# Altium project Project1.PrjPcb
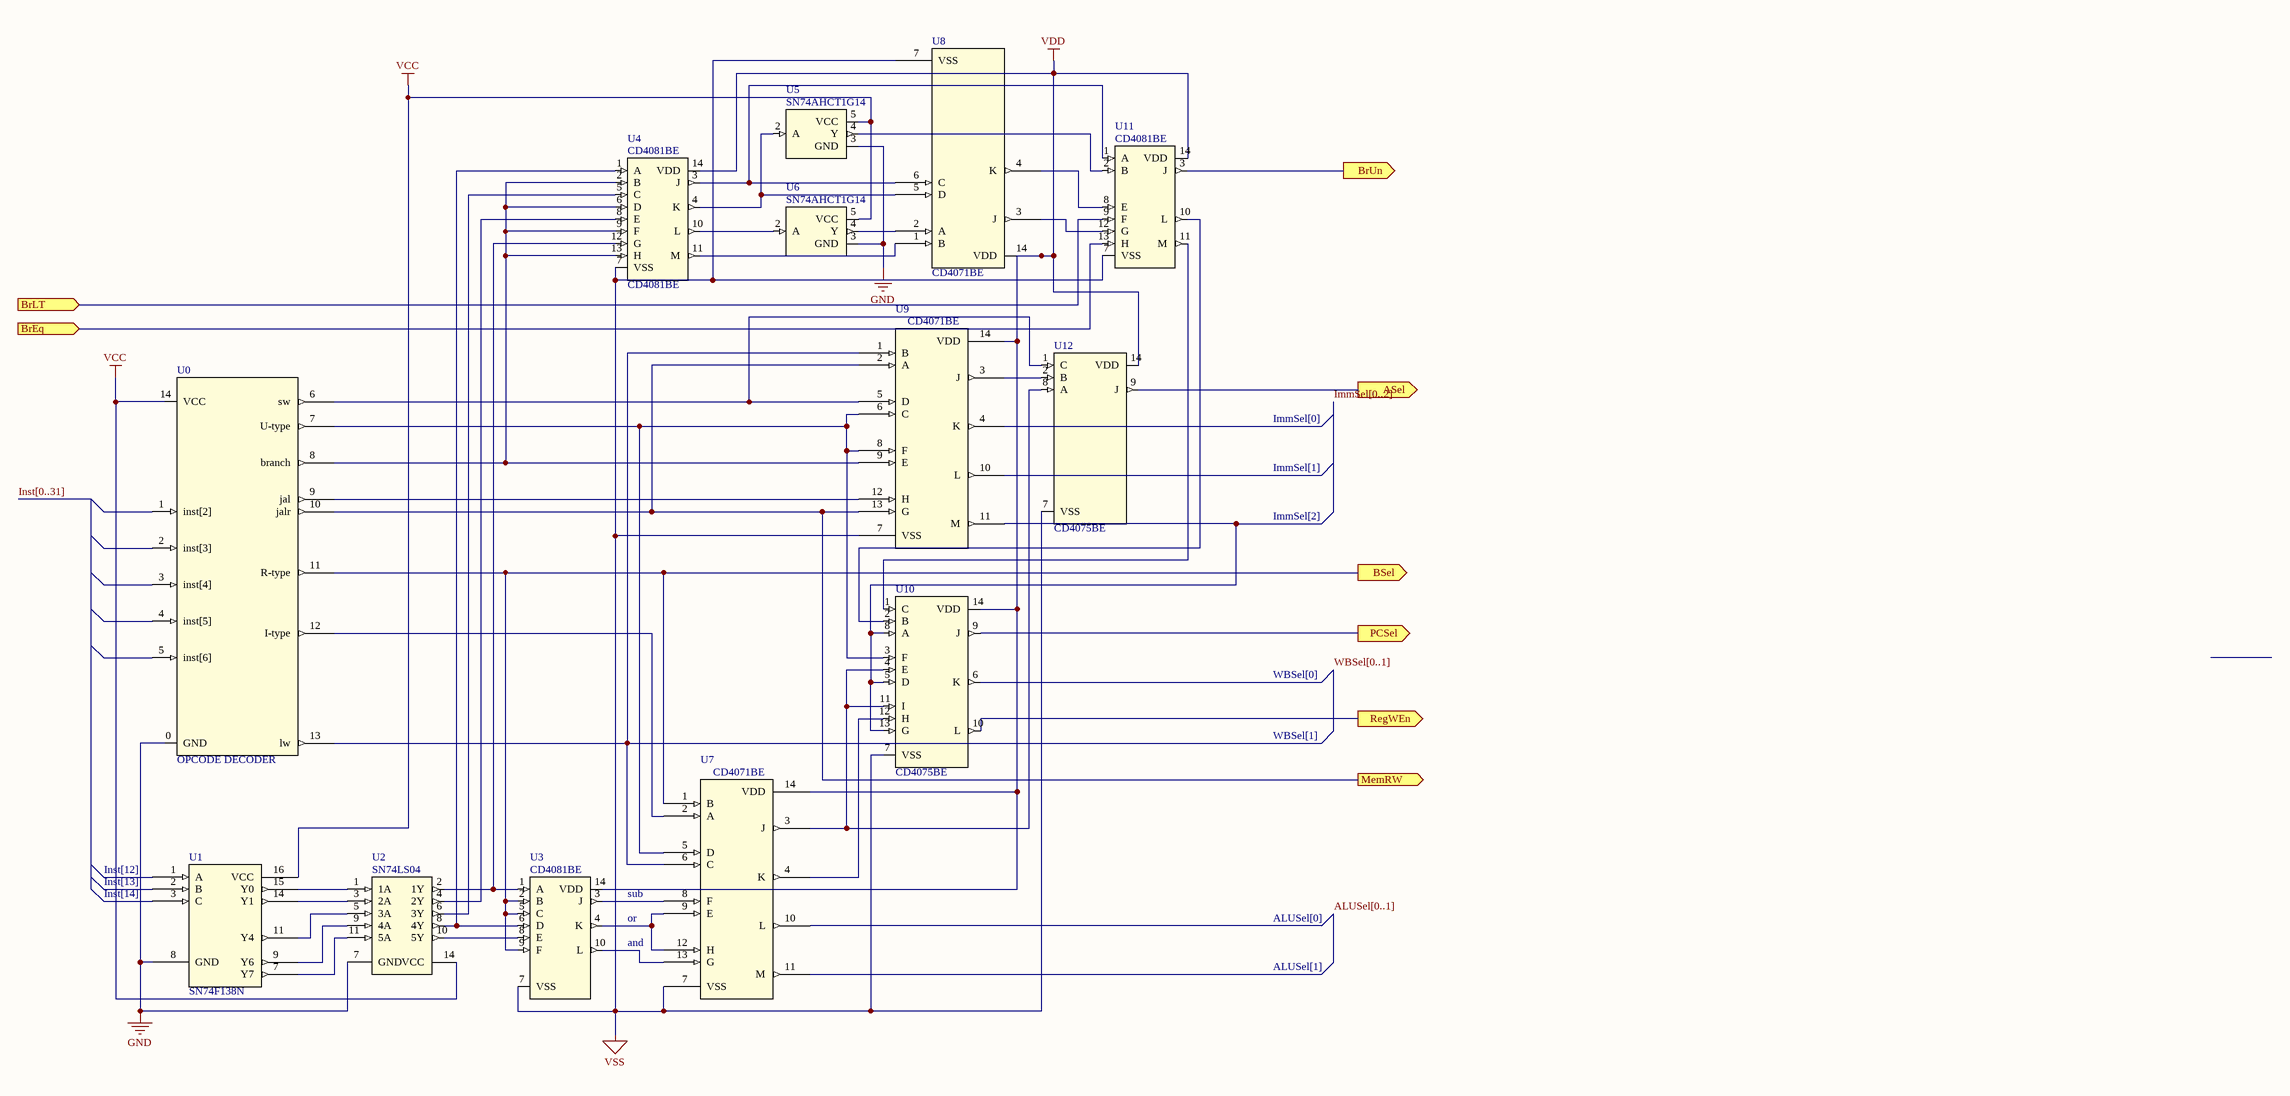
[diagram p0: project1.SchDoc]
1 sheet, 13 parts. Net scope: flat (ports and power ports of the same name join across sheets).

## Sheet project1.SchDoc
size 381 x 241 mm; SheetNumber: 1; SheetTotal: 1

### Parts
U0  OPCODE DECODER
U1  SN74F138N  [N16]
U2  SN74LS04N  [N14]  (value not drawn)
U3  CD4081BE  [N14]  (value not drawn)
U4  CD4081BE  [N14]
U5  CAHCT1G14QDCKRQ1  [DCK5_TEX]  (value not drawn)
U6  AHCT1G14QDCKRQ1  [DCK5_TEX]  (value not drawn)
U7  CD4071BE  [N14]  (value not drawn)
U8  CD4071BE  [N14]
U9  CD4071BE  [N14]  (value not drawn)
U10  CD4075BE  [N14]
U11  CD4081BE  [N14]  (value not drawn)
U12  CD4075BE  [N14]

### Ports
ASel (out), BrEq (in), BrLT (in), BrUn (out), BSel (out), MemRW (out), PCSel (out), RegWEn (out)

### Nets
GND: U0.0(GND) U1.8(GND) U2.7(GND) U5.3(GND) U6.3(GND)
VCC: U0.14(VCC) U1.16(VCC) U2.14(VCC) U5.5(VCC) U6.5(VCC)
VDD: U3.14(VDD) U4.14(VDD) U7.14(VDD) U8.14(VDD) U9.14(VDD) U10.14(VDD) U11.14(VDD) U12.14(VDD)
VSS: U3.7(VSS) U4.7(VSS) U7.7(VSS) U8.7(VSS) U9.7(VSS) U10.7(VSS) U11.7(VSS) U12.7(VSS)
NetU0_6: U0.6(sw) U9.5(D) U12.1(C)
NetU0_7: U0.7(U-type) U7.5(D) U9.6(C) U9.8(F) U10.3(F)
NetU0_8: U0.8(branch) U4.2(B) U4.6(D) U4.9(F) U4.13(H) U9.9(E)
NetU0_9: U0.9(jal) U9.12(H)
NetU0_10: U0.10(jalr) U9.2(A) U9.13(G) ; port MemRW
NetU0_11: U0.11(R-type) U3.2(B) U3.5(C) U3.9(F) U7.1(B) ; port BSel
NetU0_12: U0.12(I-type) U7.2(A)
NetU0_13: U0.13(lw) U7.6(C) U9.1(B)
NetU1_7: U1.7(Y7) U2.11(5A)
NetU1_9: U1.9(Y6) U2.9(4A)
NetU1_11: U1.11(Y4) U2.5(3A)
NetU1_14: U1.14(Y1) U2.3(2A)
NetU1_15: U1.15(Y0) U2.1(1A)
NetU2_2: U2.2(1Y) U3.1(A) U4.12(G)
NetU2_4: U2.4(2Y) U4.8(E)
NetU2_6: U2.6(3Y) U4.5(C)
NetU2_8: U2.8(4Y) U3.6(D) U4.1(A)
NetU2_10: U2.10(5Y) U3.8(E)
NetU3_3: U3.3(J) U7.8(F)
NetU3_4: U3.4(K) U7.9(E) U7.12(H)
NetU3_10: U3.10(L) U7.13(G)
NetU4_3: U4.3(J) U8.6(C) U11.1(A)
NetU4_4: U4.4(K) U5.2(A) U8.5(D)
NetU4_10: U4.10(L) U6.2(A)
NetU4_11: U4.11(M) U8.1(B)
NetU5_4: U5.4(Y) U11.2(B)
NetU6_4: U6.4(Y) U8.2(A)
NetU7_3: U7.3(J) U10.4(E) U10.11(I) U12.8(A)
NetU7_4: U7.4(K) U10.12(H)
NetU8_3: U8.3(J) U11.12(G)
NetU8_4: U8.4(K) U11.8(E)
NetU9_3: U9.3(J) U12.2(B)
NetU9_11: U9.11(M) U10.5(D) U10.8(A) U10.13(G)
NetU10_1: U10.1(C) U11.11(M)
NetU10_2: U10.2(B) U11.10(L)
NetU10_9: U10.9(J) ; port PCSel
NetU10_10: U10.10(L) ; port RegWEn
NetU11_3: U11.3(J) ; port BrUn
NetU11_9: U11.9(F) ; port BrLT
NetU11_13: U11.13(H) ; port BrEq
NetU12_9: U12.9(J) ; port ASel

Not connected (* = marked no-connect by the designer): U0 1(inst[2]) 2(inst[3]) 3(inst[4]) 4(inst[5]) 5(inst[6]); U1 1(A) 2(B) 3(C) 10(Y5) 12(Y3) 13(Y2); U2 12(6Y) 13(6A); U3 11(M) 12(G) 13(H); U7 10(L) 11(M); U8 8(F) 9(E) 10(L) 11(M) 12(H) 13(G); U9 4(K) 10(L); U10 6(K); U11 4(K) 5(C) 6(D); U12 3(F) 4(E) 5(D) 6(K) 10(L) 11(I) 12(H) 13(G)

### Buses and harness runs
bus ALUSel[0..1]
bus ImmSel[0..2]
bus Inst[0..31]
bus WBSel[0..1]

### Notes on the sheet
- ImmSel[0]
- ImmSel[1]
- ImmSel[2]
- WBSel[0]
- WBSel[1]
- (near U1) Inst[12]
- (near U1) Inst[13]
- (near U1) Inst[14]
- sub
- (near U3) or
- ALUSel[0]
- and
- ALUSel[1]
- (in symbol CAHCT1G14QDCKRQ1) SN74AHCT1G14
- (in symbol SN74LS04N) SN74LS04

### Library data of the parts
U0 = OPCODE DECODER FS
U1 = SN74F138N_1: No Description Available; Mfr_Name: Texas Instruments; Copyright: Copyright (C) 2023 Ultra Librarian. All rights reserved.; Manufacturer_Part_Number: SN74F138N; RefDes: RefDes; Type: DEV
U2 = SN74LS04N: No Description Available; Mfr_Name: Texas Instruments; Copyright: Copyright (C) 2023 Ultra Librarian. All rights reserved.; Manufacturer_Part_Number: SN74LS04N; RefDes: RefDes; Type: DEV
U3 U4 U11 = CD4081BE: No Description Available; Mfr_Name: Texas Instruments; Copyright: Copyright (C) 2023 Ultra Librarian. All rights reserved.; Manufacturer_Part_Number: CD4081BE; RefDes: RefDes; Type: DEV
U5 U6 = CAHCT1G14QDCKRQ1: No Description Available; Mfr_Name: Texas Instruments; Type: DEV; Copyright: Copyright (C) 2023 Ultra Librarian. All rights reserved.; Manufacturer_Part_Number: CAHCT1G14QDCKRQ1; RefDes: RefDes
U7-U9 = CD4071BE: No Description Available; Mfr_Name: Texas Instruments; Copyright: Copyright (C) 2023 Ultra Librarian. All rights reserved.; Manufacturer_Part_Number: CD4071BE; RefDes: RefDes; Type: DEV
U10 U12 = CD4075BE: No Description Available; Mfr_Name: Texas Instruments; Copyright: Copyright (C) 2023 Ultra Librarian. All rights reserved.; Manufacturer_Part_Number: CD4075BE; RefDes: RefDes; Type: DEV